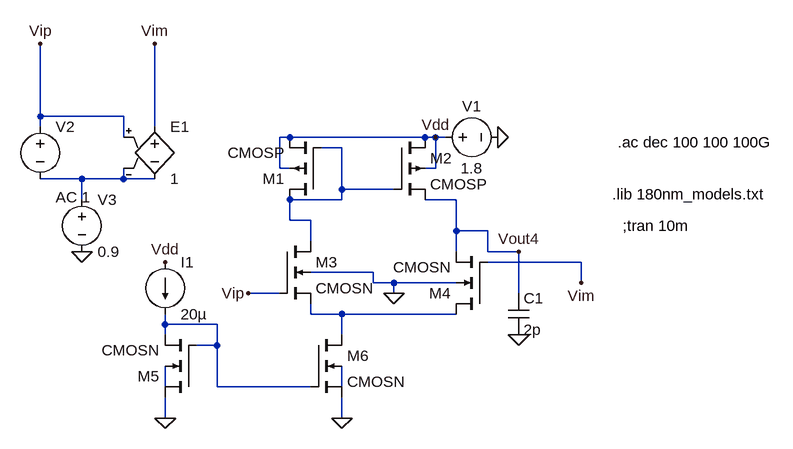
[diagram p0: schematic Gain(Differential).asc]
Gain(Differential).asc, the LTspice schematic file:
Version 4
SHEET 1 880 680
WIRE -288 16 -288 -96
WIRE -160 16 -288 16
WIRE -288 32 -288 16
WIRE -112 32 -112 -96
WIRE -160 48 -160 16
WIRE 96 48 80 48
WIRE 304 48 96 48
WIRE 320 48 304 48
WIRE 336 48 320 48
WIRE 176 64 144 64
WIRE 80 96 80 48
WIRE 96 96 80 96
WIRE 320 96 320 48
WIRE 320 96 304 96
WIRE -224 112 -288 112
WIRE -160 112 -160 96
WIRE -160 112 -224 112
WIRE -112 112 -160 112
WIRE 176 128 176 64
WIRE 256 128 176 128
WIRE -224 144 -224 112
WIRE 176 144 176 128
WIRE 176 144 96 144
WIRE 352 144 304 144
WIRE 96 176 96 144
WIRE 128 176 96 176
WIRE 352 192 352 144
WIRE 400 192 352 192
WIRE 128 208 128 176
WIRE 352 224 352 192
WIRE 400 224 400 192
WIRE 448 224 400 224
WIRE 544 240 400 240
WIRE 224 256 128 256
WIRE 224 272 224 256
WIRE 256 272 224 272
WIRE 352 272 256 272
WIRE 544 272 544 240
WIRE 80 288 32 288
WIRE 256 288 256 272
WIRE 448 288 448 224
WIRE 128 320 128 304
WIRE 176 320 128 320
WIRE 352 320 176 320
WIRE -96 336 -96 320
WIRE -16 336 -96 336
WIRE -96 352 -96 336
WIRE 176 352 176 320
WIRE -16 368 -16 336
WIRE -16 368 -48 368
WIRE -96 432 -96 400
WIRE -16 432 -16 368
WIRE 128 432 -16 432
WIRE 176 432 176 400
WIRE -96 480 -96 448
WIRE 176 480 176 448
FLAG 416 48 0
FLAG 256 288 0
FLAG -96 480 0
FLAG 176 480 0
FLAG 320 48 Vdd
FLAG -96 240 Vdd
FLAG 32 288 Vip
FLAG -224 224 0
FLAG -288 -96 Vip
FLAG -112 -96 Vim
FLAG 448 224 Vout4
FLAG 448 352 0
FLAG 544 272 Vim
SYMBOL pmos4 144 144 R180
SYMATTR InstName M1
SYMATTR Value CMOSP
SYMATTR Value2 l=0.6u w=60u
SYMBOL pmos4 256 48 R0
SYMATTR InstName M2
SYMATTR Value CMOSP
SYMATTR Value2 l=0.6u w=60u
SYMBOL nmos4 80 208 R0
SYMATTR InstName M3
SYMATTR Value CMOSN
SYMATTR Value2 l=5u w=60u
SYMBOL nmos4 400 320 R180
SYMATTR InstName M4
SYMATTR Value CMOSN
SYMATTR Value2 l=5u w=60u
SYMBOL voltage 320 48 R270
WINDOW 0 32 56 VTop 2
WINDOW 3 -32 56 VBottom 2
WINDOW 123 0 0 Left 0
WINDOW 39 0 0 Left 0
SYMATTR InstName V1
SYMATTR Value 1.8
SYMBOL nmos4 -48 448 R180
SYMATTR InstName M5
SYMATTR Value CMOSN
SYMATTR Value2 l=5u w=50u
SYMBOL nmos4 128 352 R0
SYMATTR InstName M6
SYMATTR Value CMOSN
SYMATTR Value2 l=5u w=50u m=10
SYMBOL current -96 240 R0
WINDOW 123 0 0 Left 0
WINDOW 39 0 0 Left 0
SYMATTR InstName I1
SYMATTR Value 20µ
SYMBOL voltage -288 16 R0
WINDOW 3 24 152 Left 2
WINDOW 123 24 124 Left 2
WINDOW 39 0 0 Left 0
SYMATTR Value ""
SYMATTR Value2 AC 1
SYMATTR InstName V2
SYMBOL voltage -224 128 R0
WINDOW 123 0 0 Left 0
WINDOW 39 0 0 Left 0
SYMATTR InstName V3
SYMATTR Value 0.9
SYMBOL e -112 16 R0
SYMATTR InstName E1
SYMATTR Value 1
SYMBOL cap 432 288 R0
SYMATTR InstName C1
SYMATTR Value 2p
TEXT 592 136 Left 2 !.lib 180nm_models.txt
TEXT 608 184 Left 2 !;tran 10m
TEXT 600 56 Left 2 !.ac dec 100 100 100G

The netlist it stands for:
* Gain(Differential).asc
M1 N001 N001 Vdd Vdd CMOSP l=0.6u w=60u
M2 Vdd N001 Vout4 Vdd CMOSP l=0.6u w=60u
M3 N001 Vip N003 0 CMOSN l=5u w=60u
M4 N003 Vim Vout4 0 CMOSN l=5u w=60u
V1 Vdd 0 1.8
M5 0 N004 N004 N005 CMOSN l=5u w=50u
M6 N003 N004 0 N006 CMOSN l=5u w=50u m=10
I1 Vdd N004 20µ
V2 Vip N002 AC 1
V3 N002 0 0.9
E1 Vim N002 Vip N002 1
C1 Vout4 0 2p
.model NMOS NMOS
.model PMOS PMOS
.lib standard.mos
.lib 180nm_models.txt
;tran 10m
.ac dec 100 100 100G
.backanno
.end